# Altium schematic sheet processing.SchDoc: Processing
size A2 portrait; Organization: Tweetonig; Address1: Delftsestraat 11; DocumentNumber: 6; Revision: 1.0; SheetNumber: 6; SheetTotal: 9
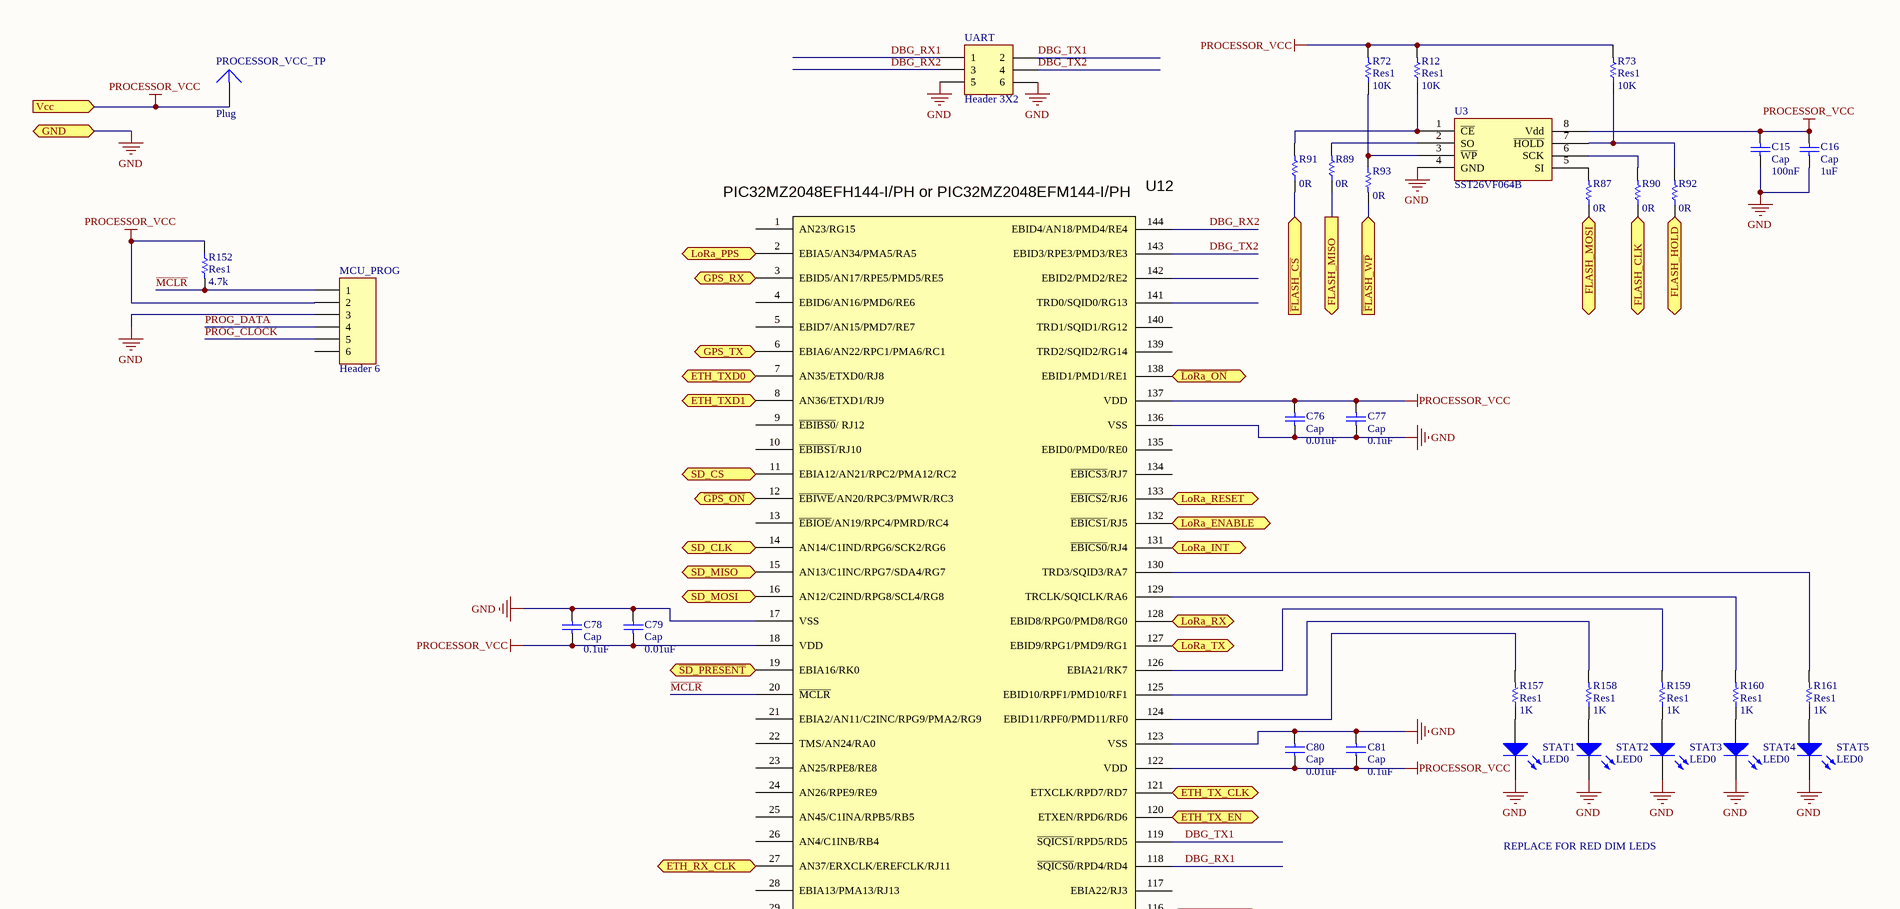
[diagram p0: processing.SchDoc, top]
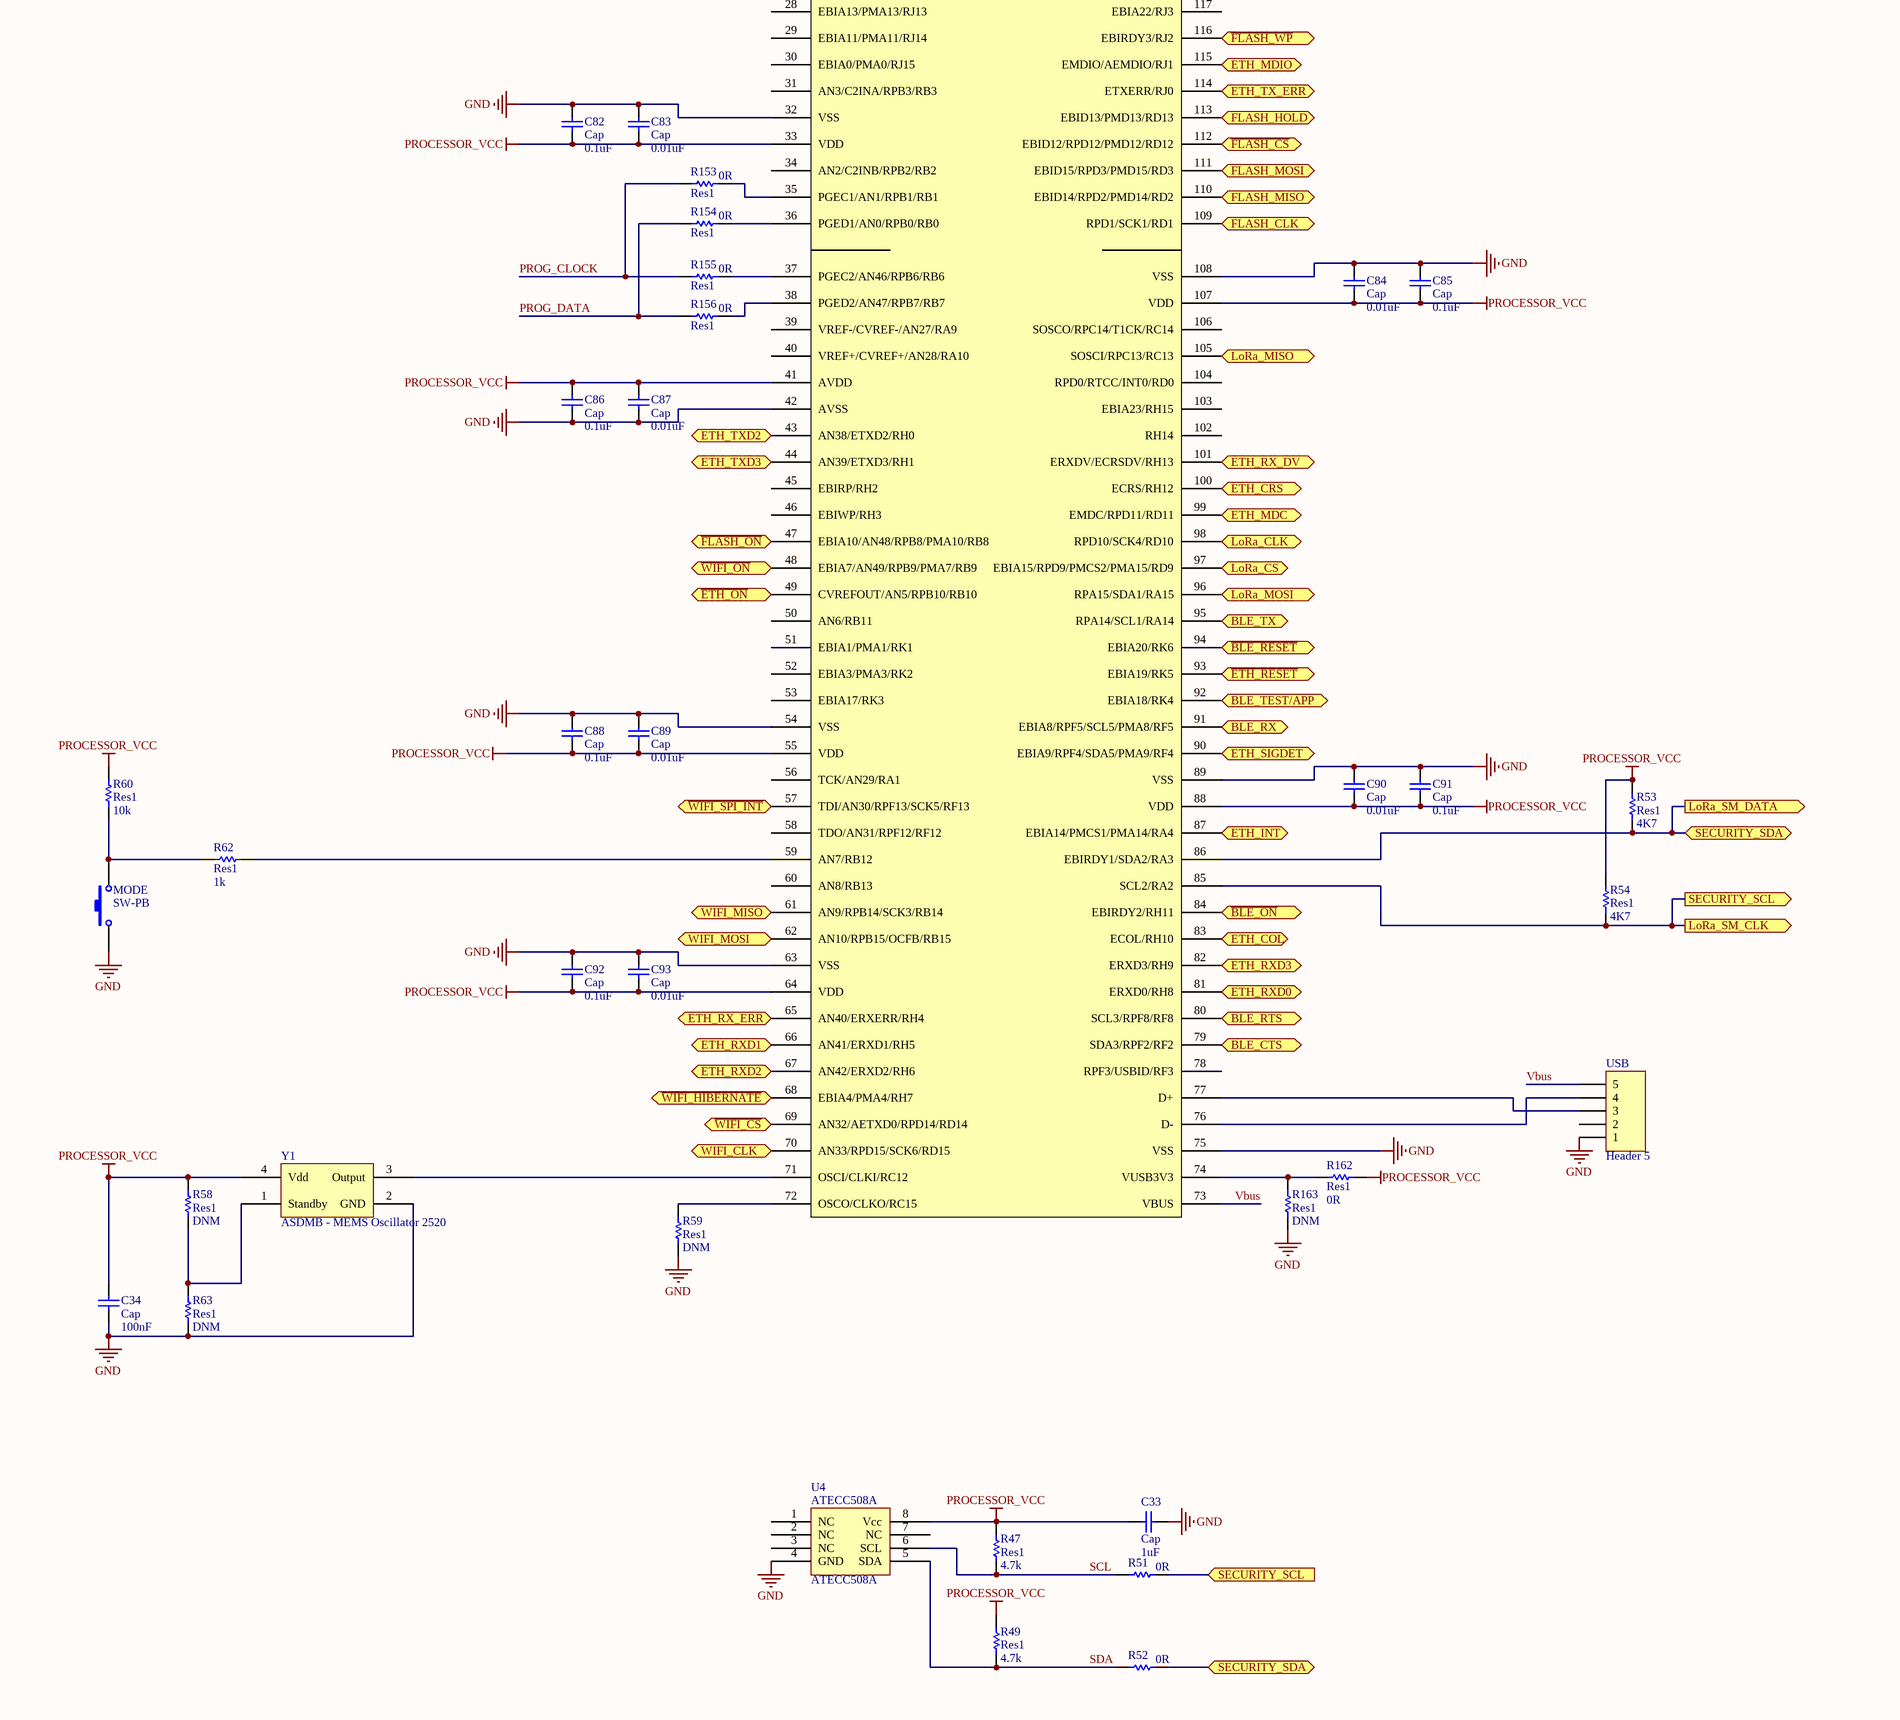
[diagram p1: processing.SchDoc, bottom]

## Parts
C15  Cap  value 100nF  [C0603]
C16  Cap  value 1uF  [C0603]
C33  Cap  value 1uF  [C0603]
C34  Cap  value 100nF  [6-0805_L]
C76  Cap  value 0.01uF  [C0603]
C77  Cap  value 0.1uF  [C0603]
C78  Cap  value 0.1uF  [C0603]
C79  Cap  value 0.01uF  [C0603]
C80  Cap  value 0.01uF  [C0603]
C81  Cap  value 0.1uF  [C0603]
C82  Cap  value 0.1uF  [C0603]
C83  Cap  value 0.01uF  [C0603]
C84  Cap  value 0.01uF  [C0603]
C85  Cap  value 0.1uF  [C0603]
C86  Cap  value 0.1uF  [C0603]
C87  Cap  value 0.01uF  [C0603]
C88  Cap  value 0.1uF  [C0603]
C89  Cap  value 0.01uF  [C0603]
C90  Cap  value 0.01uF  [C0603]
C91  Cap  value 0.1uF  [C0603]
C92  Cap  value 0.1uF  [C0603]
C93  Cap  value 0.01uF  [C0603]
MCU_PROG  Header 6  [HDR1X6]
MODE  SW-PB  [BUTTON]
PROCESSOR_VCC_TP  Plug  [PIN1]
R12  Res1  value 10K  [R0603]
R47  Res1  value 4.7k  [R0603]
R49  Res1  value 4.7k  [R0603]
R51  value 0R  [R0603]
R52  value 0R  [R0603]
R53  Res1  value 4K7  [R0603]
R54  Res1  value 4K7  [R0603]
R58  Res1  value DNM  [R0603]
R59  Res1  value DNM  [R0603]
R60  Res1  value 10k  [R0603]
R62  Res1  value 1k  [R0603]
R63  Res1  value DNM  [R0603]
R72  Res1  value 10K  [R0603]
R73  Res1  value 10K  [R0603]
R87  value 0R  [R0603]
R89  value 0R  [R0603]
R90  value 0R  [R0603]
R91  value 0R  [R0603]
R92  value 0R  [R0603]
R93  value 0R  [R0603]
R152  Res1  value 4.7k  [R0603]
R153  Res1  value 0R  [R0603]
R154  Res1  value 0R  [R0603]
R155  Res1  value 0R  [R0603]
R156  Res1  value 0R  [R0603]
R157  Res1  value 1K  [R0603]
R158  Res1  value 1K  [R0603]
R159  Res1  value 1K  [R0603]
R160  Res1  value 1K  [R0603]
R161  Res1  value 1K  [R0603]
R162  Res1  value 0R  [R0603]
R163  Res1  value DNM  [R0603]
STAT1  LED0  [C0603]
STAT2  LED0  [C0603]
STAT3  LED0  [C0603]
STAT4  LED0  [C0603]
STAT5  LED0  [C0603]
U3  SST26VF064B  [SOIJ-SM8_M]
U4  ATECC508A  [UDFN-MU8-non-thermal]
U12  PIC32MZ2048EFH144-I/PH or PIC32MZ2048EFM144-I/PH  [MCHP-TQFP-PH144_M]
UART  Header 3X2  [HDR2X3]
USB  Header 5  [Vertical MicroUSB]
Y1  ASDMB - MEMS Oscillator 2520  [BT-XTAL_2520]

## Ports
BLE_CTS (out), BLE_RTS (in), BLE_RX (out), BLE_TEST/APP (out), BLE_TX (in), ETH_COL (in), ETH_CRS (in), ETH_INT (in), ETH_MDC (out), ETH_MDIO, ETH_RX_CLK (in), ETH_RX_DV (in), ETH_RX_ERR (in), ETH_RXD0 (in), ETH_RXD1 (in), ETH_RXD2 (in), ETH_RXD3 (in), ETH_SIGDET (in), ETH_TX_CLK (in), ETH_TX_EN (out), ETH_TX_ERR (out), ETH_TXD0 (out), ETH_TXD1 (out), ETH_TXD2 (out), ETH_TXD3 (out), FLASH_CLK (in), FLASH_CLK (out), FLASH_HOLD (in), FLASH_HOLD (out), FLASH_MISO (in), FLASH_MISO (out), FLASH_MOSI (in), FLASH_MOSI (out), GND (bidir), GPS_RX (out), GPS_TX (in), LoRa_CLK (out), LoRa_CS (out), LoRa_ENABLE (out), LoRa_INT (in), LoRa_MISO (in), LoRa_MOSI (out), LoRa_PPS (out), LoRa_RESET (out), LoRa_RX (out), LoRa_SM_CLK (out), LoRa_SM_DATA (out), LoRa_TX (in), SD_CLK (out), SD_CS (out), SD_MISO (in), SD_MOSI (out), SECURITY_SCL (in), SECURITY_SCL (out), SECURITY_SDA (bidir), Vcc (in), WIFI_CLK (out), WIFI_MISO (in), WIFI_MOSI (out), ~{BLE_ON} (out), ~{BLE_RESET} (out), ~{ETH_ON} (in), ~{ETH_RESET} (out), ~{FLASH_CS} (in), ~{FLASH_CS} (out), ~{FLASH_ON} (in), ~{FLASH_WP} (in), ~{FLASH_WP} (out), ~{GPS_ON} (out), ~{LoRa_ON} (out), ~{SD_PRESENT} (in), ~{WIFI_CS} (out), ~{WIFI_HIBERNATE} (out), ~{WIFI_ON} (in), ~{WIFI_SPI_INT} (in)

## Nets
GND: C15.1 C16.1 C33.1 C34.1 C76.2 C77.2 C78.2 C79.2 C80.2 C81.2 C82.2 C83.2 C84.2 C85.2 C86.1 C87.1 C88.2 C89.2 C90.2 C91.2 C92.2 C93.2 MCU_PROG.3 MODE.1 R59.1 R63.1 R163.1 STAT1.2(K) STAT2.2(K) STAT3.2(K) STAT4.2(K) STAT5.2(K) U3.4(GND) U4.4(GND) U12.17(VSS) U12.32(VSS) U12.42(AVSS) U12.54(VSS) U12.63(VSS) U12.75(VSS) U12.89(VSS) U12.108(VSS) U12.123(VSS) U12.136(VSS) UART.5 UART.6 USB.1 Y1.2(GND) ; port GND
PROCESSOR_VCC: C15.2 C16.2 C33.2 C34.2 C76.1 C77.1 C78.1 C79.1 C80.1 C81.1 C82.1 C83.1 C84.1 C85.1 C86.2 C87.2 C88.1 C89.1 C90.1 C91.1 C92.1 C93.1 MCU_PROG.2 PROCESSOR_VCC_TP.1 R12.2 R47.1 R49.1 R53.1 R54.1 R58.2 R60.1 R72.2 R73.2 R152.1 R162.2 U3.8(Vdd) U4.8(Vcc) U12.18(VDD) U12.33(VDD) U12.41(AVDD) U12.55(VDD) U12.64(VDD) U12.88(VDD) U12.107(VDD) U12.122(VDD) U12.137(VDD) Y1.4(Vdd) ; port Vcc
~{BLE_ON}: U12.84(EBIRDY2/RH11) ; port ~{BLE_ON}
~{BLE_RESET}: U12.94(EBIA20/RK6) ; port ~{BLE_RESET}
~{ETH_ON}: U12.49(CVREFOUT/AN5/RPB10/RB10) ; port ~{ETH_ON}
~{ETH_RESET}: U12.93(EBIA19/RK5) ; port ~{ETH_RESET}
~{FLASH_CS}: R91.1 U12.112(EBID12/RPD12/PMD12/RD12) ; port ~{FLASH_CS}
~{FLASH_ON}: U12.47(EBIA10/AN48/RPB8/PMA10/RB8) ; port ~{FLASH_ON}
~{FLASH_WP}: R93.2 U12.116(EBIRDY3/RJ2) ; port ~{FLASH_WP}
~{GPS_ON}: U12.12(~{EBIWE}/AN20/RPC3/PMWR/RC3) ; port ~{GPS_ON}
~{LoRa_ON}: U12.138(EBID1/PMD1/RE1) ; port ~{LoRa_ON}
~{MCLR}: MCU_PROG.1 R152.2 U12.20(~{MCLR})
~{SD_PRESENT}: U12.19(EBIA16/RK0) ; port ~{SD_PRESENT}
~{WIFI_CS}: U12.69(AN32/AETXD0/RPD14/RD14) ; port ~{WIFI_CS}
~{WIFI_HIBERNATE}: U12.68(EBIA4/PMA4/RH7) ; port ~{WIFI_HIBERNATE}
~{WIFI_ON}: U12.48(EBIA7/AN49/RPB9/PMA7/RB9) ; port ~{WIFI_ON}
~{WIFI_SPI_INT}: U12.57(TDI/AN30/RPF13/SCK5/RF13) ; port ~{WIFI_SPI_INT}
BLE_CTS: U12.79(SDA3/RPF2/RF2) ; port BLE_CTS
BLE_RTS: U12.80(SCL3/RPF8/RF8) ; port BLE_RTS
BLE_RX: U12.91(EBIA8/RPF5/SCL5/PMA8/RF5) ; port BLE_RX
BLE_TEST/APP: U12.92(EBIA18/RK4) ; port BLE_TEST/APP
BLE_TX: U12.95(RPA14/SCL1/RA14) ; port BLE_TX
DBG_RX1: U12.118(~{SQICS0}/RPD4/RD4) UART.1
DBG_RX2: U12.144(EBID4/AN18/PMD4/RE4) UART.3
DBG_TX1: U12.119(~{SQICS1}/RPD5/RD5) UART.2
DBG_TX2: U12.143(EBID3/RPE3/PMD3/RE3) UART.4
ETH_COL: U12.83(ECOL/RH10) ; port ETH_COL
ETH_CRS: U12.100(ECRS/RH12) ; port ETH_CRS
ETH_INT: U12.87(EBIA14/PMCS1/PMA14/RA4) ; port ETH_INT
ETH_MDC: U12.99(EMDC/RPD11/RD11) ; port ETH_MDC
ETH_MDIO: U12.115(EMDIO/AEMDIO/RJ1) ; port ETH_MDIO
ETH_RX_CLK: U12.27(AN37/ERXCLK/EREFCLK/RJ11) ; port ETH_RX_CLK
ETH_RX_DV: U12.101(ERXDV/ECRSDV/RH13) ; port ETH_RX_DV
ETH_RX_ERR: U12.65(AN40/ERXERR/RH4) ; port ETH_RX_ERR
ETH_RXD0: U12.81(ERXD0/RH8) ; port ETH_RXD0
ETH_RXD1: U12.66(AN41/ERXD1/RH5) ; port ETH_RXD1
ETH_RXD2: U12.67(AN42/ERXD2/RH6) ; port ETH_RXD2
ETH_RXD3: U12.82(ERXD3/RH9) ; port ETH_RXD3
ETH_SIGDET: U12.90(EBIA9/RPF4/SDA5/PMA9/RF4) ; port ETH_SIGDET
ETH_TX_CLK: U12.121(ETXCLK/RPD7/RD7) ; port ETH_TX_CLK
ETH_TX_EN: U12.120(ETXEN/RPD6/RD6) ; port ETH_TX_EN
ETH_TX_ERR: U12.114(ETXERR/RJ0) ; port ETH_TX_ERR
ETH_TXD0: U12.7(AN35/ETXD0/RJ8) ; port ETH_TXD0
ETH_TXD1: U12.8(AN36/ETXD1/RJ9) ; port ETH_TXD1
ETH_TXD2: U12.43(AN38/ETXD2/RH0) ; port ETH_TXD2
ETH_TXD3: U12.44(AN39/ETXD3/RH1) ; port ETH_TXD3
FLASH_CLK: R90.1 U12.109(RPD1/SCK1/RD1) ; port FLASH_CLK
FLASH_HOLD: R92.1 U12.113(EBID13/PMD13/RD13) ; port FLASH_HOLD
FLASH_MISO: R89.1 U12.110(EBID14/RPD2/PMD14/RD2) ; port FLASH_MISO
FLASH_MOSI: R87.1 U12.111(EBID15/RPD3/PMD15/RD3) ; port FLASH_MOSI
GPS_RX: U12.3(EBID5/AN17/RPE5/PMD5/RE5) ; port GPS_RX
GPS_TX: U12.6(EBIA6/AN22/RPC1/PMA6/RC1) ; port GPS_TX
LoRa_CLK: U12.98(RPD10/SCK4/RD10) ; port LoRa_CLK
LoRa_CS: U12.97(EBIA15/RPD9/PMCS2/PMA15/RD9) ; port LoRa_CS
LoRa_ENABLE: U12.132(~{EBICS1}/RJ5) ; port LoRa_ENABLE
LoRa_INT: U12.131(~{EBICS0}/RJ4) ; port LoRa_INT
LoRa_MISO: U12.105(SOSCI/RPC13/RC13) ; port LoRa_MISO
LoRa_MOSI: U12.96(RPA15/SDA1/RA15) ; port LoRa_MOSI
LoRa_PPS: U12.2(EBIA5/AN34/PMA5/RA5) ; port LoRa_PPS
LoRa_RESET: U12.133(~{EBICS2}/RJ6) ; port LoRa_RESET
LoRa_RX: U12.128(EBID8/RPG0/PMD8/RG0) ; port LoRa_RX
LoRa_SM_CLK: R51.2 R54.2 U12.85(SCL2/RA2) ; port LoRa_SM_CLK, port SECURITY_SCL
LoRa_SM_DATA: R52.2 R53.2 U12.86(EBIRDY1/SDA2/RA3) ; port LoRa_SM_DATA, port SECURITY_SDA
LoRa_TX: U12.127(EBID9/RPG1/PMD9/RG1) ; port LoRa_TX
PROG_CLOCK: MCU_PROG.5 R153.2 R155.2
PROG_DATA: MCU_PROG.4 R154.2 R156.2
SCL: R47.2 R51.1 U4.6(SCL)
SD_CLK: U12.14(AN14/C1IND/RPG6/SCK2/RG6) ; port SD_CLK
SD_CS: U12.11(EBIA12/AN21/RPC2/PMA12/RC2) ; port SD_CS
SD_MISO: U12.15(AN13/C1INC/RPG7/SDA4/RG7) ; port SD_MISO
SD_MOSI: U12.16(AN12/C2IND/RPG8/SCL4/RG8) ; port SD_MOSI
SDA: R49.2 R52.1 U4.5(SDA)
Vbus: U12.73(VBUS) USB.5
WIFI_CLK: U12.70(AN33/RPD15/SCK6/RD15) ; port WIFI_CLK
WIFI_MISO: U12.61(AN9/RPB14/SCK3/RB14) ; port WIFI_MISO
WIFI_MOSI: U12.62(AN10/RPB15/OCFB/RB15) ; port WIFI_MOSI
NetMODE_2: MODE.2 R60.2 R62.1
NetR12_1: R12.1 R91.2 U3.1(~{CE})
NetR58_1: R58.1 R63.2 Y1.1(Standby)
NetR59_2: R59.2 U12.72(OSCO/CLKO/RC15)
NetR62_2: R62.2 U12.59(AN7/RB12)
NetR72_1: R72.1 R93.1 U3.3(~{WP})
NetR73_1: R73.1 R92.2 U3.7(~{HOLD})
NetR87_2: R87.2 U3.5(SI)
NetR89_2: R89.2 U3.2(SO)
NetR90_2: R90.2 U3.6(SCK)
NetR153_1: R153.1 U12.35(PGEC1/AN1/RPB1/RB1)
NetR154_1: R154.1 U12.36(PGED1/AN0/RPB0/RB0)
NetR155_1: R155.1 U12.37(PGEC2/AN46/RPB6/RB6)
NetR156_1: R156.1 U12.38(PGED2/AN47/RPB7/RB7)
NetR157_1: R157.1 STAT1.1(A)
NetR157_2: R157.2 U12.124(EBID11/RPF0/PMD11/RF0)
NetR158_1: R158.1 STAT2.1(A)
NetR158_2: R158.2 U12.125(EBID10/RPF1/PMD10/RF1)
NetR159_1: R159.1 STAT3.1(A)
NetR159_2: R159.2 U12.126(EBIA21/RK7)
NetR160_1: R160.1 STAT4.1(A)
NetR160_2: R160.2 U12.129(TRCLK/SQICLK/RA6)
NetR161_1: R161.1 STAT5.1(A)
NetR161_2: R161.2 U12.130(TRD3/SQID3/RA7)
NetR162_1: R162.1 R163.2 U12.74(VUSB3V3)
NetU12_71: U12.71(OSCI/CLKI/RC12) Y1.3(Output)
NetU12_76: U12.76(D-) USB.4
NetU12_77: U12.77(D+) USB.3

Not connected (* = marked no-connect by the designer): MCU_PROG 6; U4 1(NC) 2(NC) 3(NC) 7(NC); U12 1(AN23/RG15) 4(EBID6/AN16/PMD6/RE6) 5(EBID7/AN15/PMD7/RE7) 9(~{EBIBS0}/_RJ12) 10(~{EBIBS1}/RJ10) 13(~{EBIOE}/AN19/RPC4/PMRD/RC4) 21(EBIA2/AN11/C2INC/RPG9/PMA2/RG9) 22(TMS/AN24/RA0) 23(AN25/RPE8/RE8) 24(AN26/RPE9/RE9) 25(AN45/C1INA/RPB5/RB5) 26(AN4/C1INB/RB4) 28(EBIA13/PMA13/RJ13) 29(EBIA11/PMA11/RJ14) 30(EBIA0/PMA0/RJ15) 31(AN3/C2INA/RPB3/RB3) 34(AN2/C2INB/RPB2/RB2) 39(VREF-/CVREF-/AN27/RA9) 40(VREF+/CVREF+/AN28/RA10) 45(EBIRP/RH2) 46(EBIWP/RH3) 50(AN6/RB11) 51(EBIA1/PMA1/RK1) 52(EBIA3/PMA3/RK2) 53(EBIA17/RK3) 56(TCK/AN29/RA1) 58(TDO/AN31/RPF12/RF12) 60(AN8/RB13) 78(RPF3/USBID/RF3) 102(RH14) 103(EBIA23/RH15) 104(RPD0/RTCC/INT0/RD0) 106(SOSCO/RPC14/T1CK/RC14) 117(EBIA22/RJ3) 134(~{EBICS3}/RJ7) 135(EBID0/PMD0/RE0) 139(TRD2/SQID2/RG14) 140(TRD1/SQID1/RG12) 141(TRD0/SQID0/RG13) 142(EBID2/PMD2/RE2); USB 2

## Notes on the sheet
- REPLACE FOR RED DIM LEDS
- Title
- The Things Products
- Size:
- Date:
- Project:
- A3
- Number:
- Time:
- Revision:
- Sheet
- of
- File:

## Library data of the parts
C15 C16 C33 C34 C76-C93 = Cap: Capacitor; Published: 8-Jun-2000; LatestRevisionDate: 17-Jul-2002; LatestRevisionNote: Re-released for DXP Platform.; PackageReference: RAD-0.3; Publisher: Altium Limited; PackageDescription: Radial Cap, Thru-Hole; 2 Leads; 0.3 in Pin Spacing
MCU_PROG = Header 6: Header, 6-Pin; LatestRevisionDate: 17-Jul-2002; LatestRevisionNote: Re-released for DXP Platform.; Publisher: Altium Limited
MODE = SW-PB: Switch; Published: 24-Mar-1999; LatestRevisionDate: 17-Jul-2002; LatestRevisionNote: Re-released for DXP Platform.; PackageReference: SPST-2; Publisher: Altium Limited; PackageDescription: Switch; 2 Leads
R12 R47 R49 R51-R54 R58-R60 R62 R63 R72 R73 R87 R89-R93 R152-R163 = Res1: Resistor; Published: 8-Jun-2000; LatestRevisionDate: 17-Jul-2002; LatestRevisionNote: Re-released for DXP Platform.; PackageReference: AXIAL-0.3; Publisher: Altium Limited; PackageDescription: Axial Device, Thru-Hole; 2 Leads; 0.3 in Pin Spacing
STAT1-STAT5 = LED0: Typical INFRARED GaAs LED; Published: 8-Jun-2000; LatestRevisionDate: 08-Jul-2005; LatestRevisionNote: Mech Layer 1 removed.; PackageReference: LED-0; Publisher: Altium Limited; PackageDescription: LED; 2 Leads
U3 = SST26VF064B: SST26VF064B Microchip SPI Flash Memory 64Mbit
U12 = PIC32MZ2056ECE144_144TQFP_Chicagoland: PIC32MZ2056ECE144 Chicagoland; Manufacturer: Microchip
UART = Header 3X2: Header, 3-Pin, Dual row; LatestRevisionDate: 17-Jul-2002; LatestRevisionNote: Re-released for DXP Platform.; Publisher: Altium Limited
USB = Header 5: Header, 5-Pin; LatestRevisionDate: 17-Jul-2002; LatestRevisionNote: Re-released for DXP Platform.; Publisher: Altium Limited
PROCESSOR_VCC_TP = Plug: LatestRevisionDate: 17-Jul-2002; LatestRevisionNote: Re-released for DXP Platform.; Publisher: Altium Limited